# Altium schematic sheet IMU_MAG.SchDoc: MoonPilot - IMU & MAG
size A3; DrawnBy: Máni Magnússon; Revision: A; SheetNumber: 4
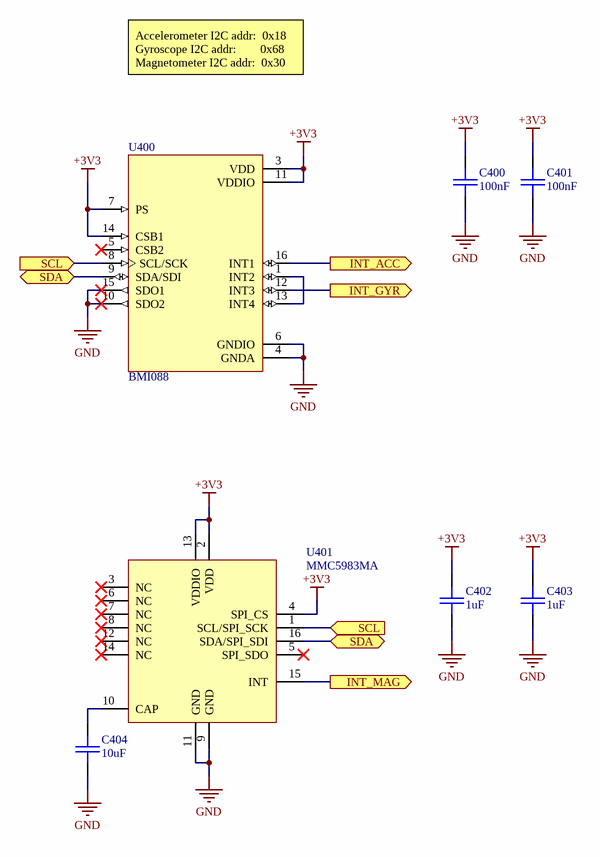
[diagram p0: IMU_MAG.SchDoc]

## Parts
C400  100nF  [0603_CAP]
C401  100nF  [0603_CAP]
C402  1uF  [0603_CAP]
C403  1uF  [0603_CAP]
C404  10uF  [0603_CAP]
U400  BMI088  [BMI088]
U401  MMC5983MA  [MMC5983MA]

## Ports
INT_ACC (out), INT_GYR (out), INT_MAG (out), SCL (in), SDA (bidir)

## Nets
+3V3: C400.1 C401.1 C402.1 C403.1 U400.3(VDD) U400.7(PS) U400.11(VDDIO) U400.14(CSB1) U401.2(VDD) U401.4(SPI_CS) U401.13(VDDIO)
GND: C400.2 C401.2 C402.2 C403.2 C404.2 U400.4(GNDA) U400.6(GNDIO) U400.10(SDO2) U400.15(SDO1) U401.9(GND) U401.11(GND)
INT_ACC: U400.16(INT1) ; port INT_ACC
INT_GYR: U400.12(INT3) ; port INT_GYR
INT_MAG: U401.15(INT) ; port INT_MAG
SCL: U400.8(SCL/SCK) U401.1(SCL/SPI_SCK) ; port SCL
SDA: U400.9(SDA/SDI) U401.16(SDA/SPI_SDI) ; port SDA
NetC404_1: C404.1 U401.10(CAP)
NetU400_1: U400.1(INT2) U400.13(INT4)

Not connected (* = marked no-connect by the designer): U400 5(CSB2)*; U401 3(NC)* 5(SPI_SDO)* 6(NC)* 7(NC)* 8(NC)* 12(NC)* 14(NC)*

## Notes on the sheet
- Accelerometer I2C addr:  0x18
  Gyroscope I2C addr:        0x68
  Magnetometer I2C addr:  0x30
- Sheet title:
- Revision:
- Drawn by:
- Date:
- File:

## Library data of the parts
C400-C404 = Capacitor
U400 = BMI088: Digikey part no. 828-1082-1-ND; MF: Bosch Sensortec; Availability: Unavailable; MP: BMI088; Price: None; Value: *; SnapEDA_Link: https://www.snapeda.com/parts/BMI088/Bosch%20Sensortec/view-part/2774026/?ref=snap; Package: VFLGA-16 Bosch Sensortec
U401 = MMC5983MA: 3 axis magnetometer; Supplier 1: Digi-Key; Supplier Part Number 1: 1267-MMC5983MACT-ND